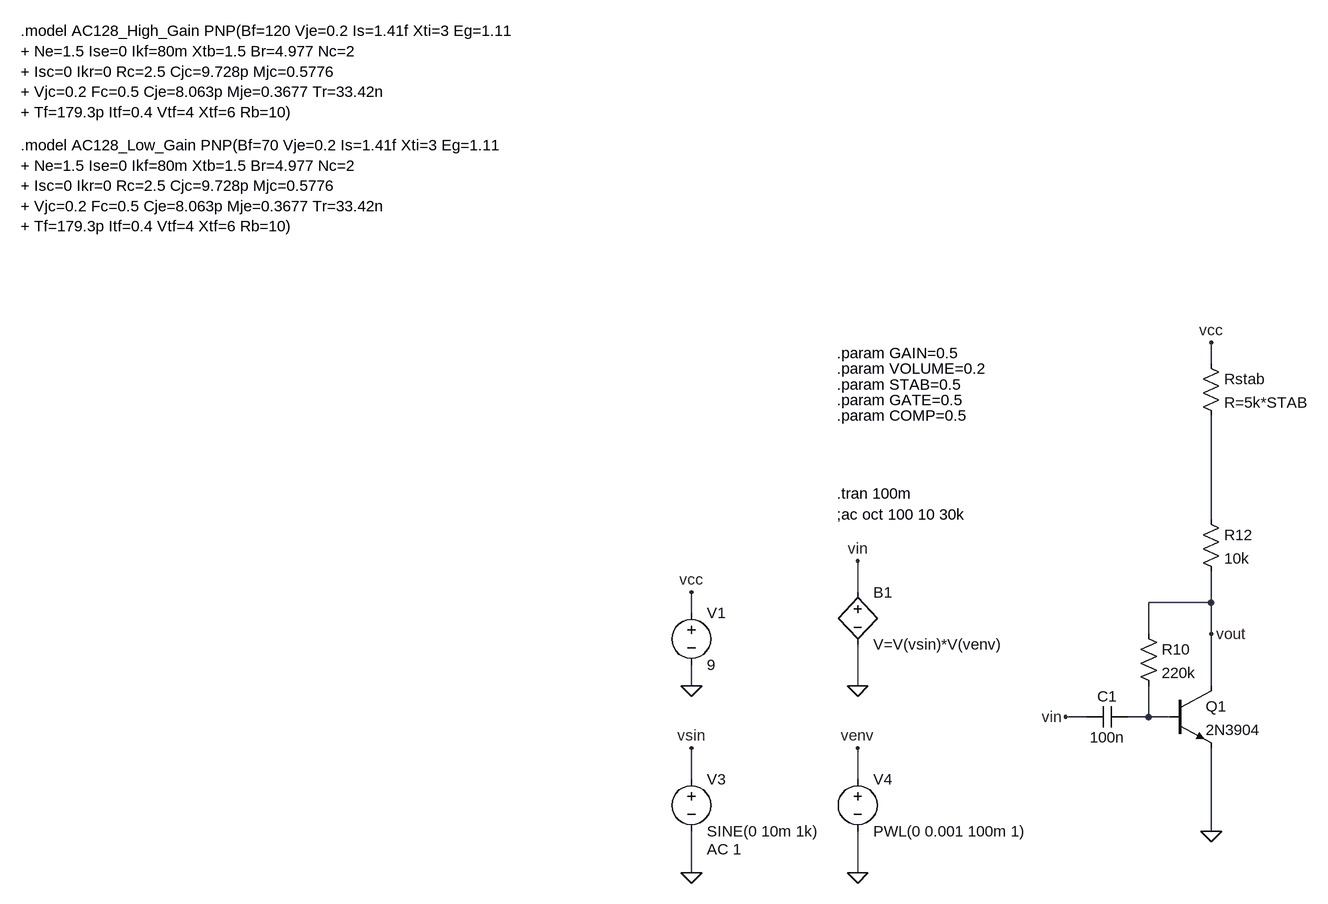
[diagram p0: schematic fuzz_factory_base_03.asc]
fuzz_factory_base_03.asc, the LTspice schematic file:
Version 4
SHEET 1 1968 1668
WIRE 32 -272 32 -304
WIRE 32 -32 32 -192
WIRE -512 80 -512 32
WIRE 32 96 32 48
WIRE 32 96 -64 96
WIRE -768 112 -768 80
WIRE -64 144 -64 96
WIRE 32 144 32 96
WIRE -768 224 -768 192
WIRE -512 224 -512 160
WIRE 32 224 32 144
WIRE -160 272 -192 272
WIRE -64 272 -64 224
WIRE -64 272 -96 272
WIRE -32 272 -64 272
WIRE -768 368 -768 320
WIRE -512 368 -512 320
WIRE 32 448 32 320
WIRE -768 512 -768 448
WIRE -512 512 -512 448
FLAG -768 80 vcc
FLAG -768 224 0
FLAG -512 224 0
FLAG -768 512 0
FLAG -512 512 0
FLAG -768 320 vsin
FLAG -512 320 venv
FLAG 32 448 0
FLAG 32 -304 vcc
FLAG -512 32 vin
FLAG -192 272 vin
FLAG 32 144 vout
SYMBOL voltage -768 96 R0
WINDOW 123 0 0 Left 2
WINDOW 39 0 0 Left 2
SYMATTR InstName V1
SYMATTR Value 9
SYMBOL voltage -768 352 R0
WINDOW 123 24 124 Left 2
WINDOW 39 0 0 Left 2
SYMATTR Value2 AC 1
SYMATTR InstName V3
SYMATTR Value SINE(0 10m 1k)
SYMBOL voltage -512 352 R0
WINDOW 123 0 0 Left 2
WINDOW 39 0 0 Left 2
SYMATTR InstName V4
SYMATTR Value PWL(0 0.001 100m 1)
SYMBOL bv -512 64 R0
SYMATTR InstName B1
SYMATTR Value V=V(vsin)*V(venv)
SYMBOL cap -96 256 R90
WINDOW 0 0 32 VBottom 2
WINDOW 3 32 32 VTop 2
SYMATTR InstName C1
SYMATTR Value 100n
SYMBOL npn -32 224 R0
SYMATTR InstName Q1
SYMATTR Value 2N3904
SYMBOL res -80 128 R0
SYMATTR InstName R10
SYMATTR Value 220k
SYMBOL res 16 -48 R0
SYMATTR InstName R12
SYMATTR Value 10k
SYMBOL res 16 -288 R0
SYMATTR InstName Rstab
SYMATTR Value R=5k*STAB
TEXT -544 -288 Left 2 !.param GAIN=0.5
TEXT -544 -264 Left 2 !.param VOLUME=0.2
TEXT -544 -240 Left 2 !.param STAB=0.5
TEXT -544 -72 Left 2 !.tran 100m
TEXT -544 -40 Left 2 !;ac oct 100 10 30k
TEXT -1800 -608 Left 2 !.model AC128_Low_Gain PNP(Bf=70 Vje=0.2 Is=1.41f Xti=3 Eg=1.11\n+ Ne=1.5 Ise=0 Ikf=80m Xtb=1.5 Br=4.977 Nc=2\n+ Isc=0 Ikr=0 Rc=2.5 Cjc=9.728p Mjc=0.5776\n+ Vjc=0.2 Fc=0.5 Cje=8.063p Mje=0.3677 Tr=33.42n\n+ Tf=179.3p Itf=0.4 Vtf=4 Xtf=6 Rb=10)
TEXT -1800 -784 Left 2 !.model AC128_High_Gain PNP(Bf=120 Vje=0.2 Is=1.41f Xti=3 Eg=1.11\n+ Ne=1.5 Ise=0 Ikf=80m Xtb=1.5 Br=4.977 Nc=2\n+ Isc=0 Ikr=0 Rc=2.5 Cjc=9.728p Mjc=0.5776\n+ Vjc=0.2 Fc=0.5 Cje=8.063p Mje=0.3677 Tr=33.42n\n+ Tf=179.3p Itf=0.4 Vtf=4 Xtf=6 Rb=10)
TEXT -544 -216 Left 2 !.param GATE=0.5
TEXT -544 -192 Left 2 !.param COMP=0.5

The netlist it stands for:
* fuzz_factory_base_03.asc
V1 vcc 0 9
V3 vsin 0 SINE(0 10m 1k) AC 1
V4 venv 0 PWL(0 0.001 100m 1)
B1 vin 0 V=V(vsin)*V(venv)
C1 N002 vin 100n
Q1 vout N002 0 0 2N3904
R10 vout N002 220k
R12 N001 vout 10k
Rstab vcc N001 R=5k*STAB
.model NPN NPN
.model PNP PNP
.lib standard.bjt
.param GAIN=0.5
.param VOLUME=0.2
.param STAB=0.5
.tran 100m
;ac oct 100 10 30k
.model AC128_Low_Gain PNP(Bf=70 Vje=0.2 Is=1.41f Xti=3 Eg=1.11
+ Ne=1.5 Ise=0 Ikf=80m Xtb=1.5 Br=4.977 Nc=2
+ Isc=0 Ikr=0 Rc=2.5 Cjc=9.728p Mjc=0.5776
+ Vjc=0.2 Fc=0.5 Cje=8.063p Mje=0.3677 Tr=33.42n
+ Tf=179.3p Itf=0.4 Vtf=4 Xtf=6 Rb=10)
.model AC128_High_Gain PNP(Bf=120 Vje=0.2 Is=1.41f Xti=3 Eg=1.11
+ Ne=1.5 Ise=0 Ikf=80m Xtb=1.5 Br=4.977 Nc=2
+ Isc=0 Ikr=0 Rc=2.5 Cjc=9.728p Mjc=0.5776
+ Vjc=0.2 Fc=0.5 Cje=8.063p Mje=0.3677 Tr=33.42n
+ Tf=179.3p Itf=0.4 Vtf=4 Xtf=6 Rb=10)
.param GATE=0.5
.param COMP=0.5
.backanno
.end